# EAGLE design DualJoyDivision (EAGLE 7.6.0)
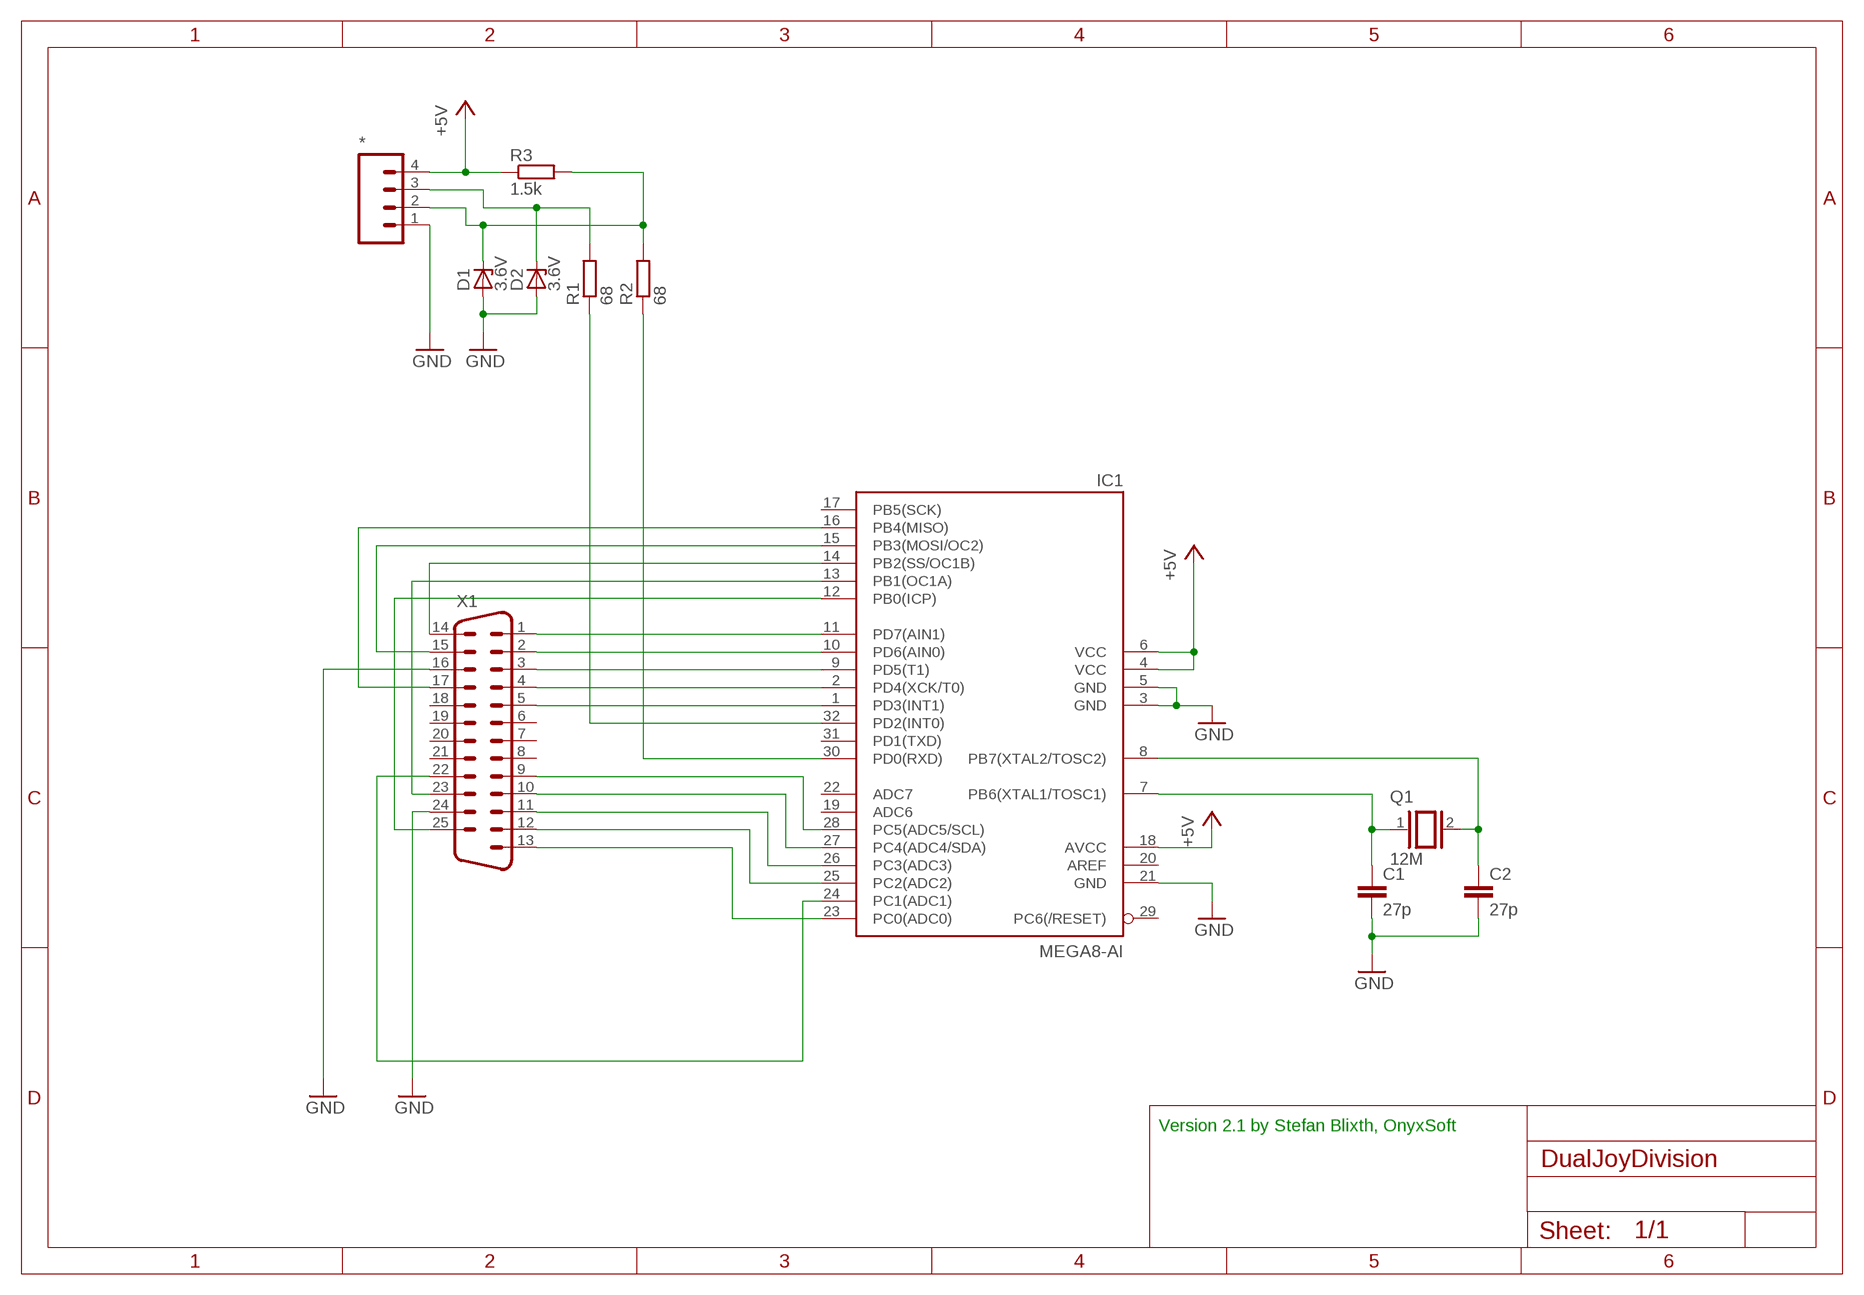
[diagram p0: schematic, sheet 1]

## Parts
*  M04PTH  [1X04]
C1  27p  C-EUC0805  [C0805]
C2  27p  C-EUC0805  [C0805]
D1  3.6V  ZENER-DIODESOD80C  [SOD80C]
D2  3.6V  ZENER-DIODESOD80C  [SOD80C]
IC1  MEGA8-AI  [TQFP32-08]
Q1  12M  XTAL/S  [QS]
R1  68  R-EU_M0805  [M0805]
R2  68  R-EU_M0805  [M0805]
R3  1.5k  R-EU_M0805  [M0805]
X1  DB25D  [M25D]

## Nets
+5V: *.4 IC1.4(VCC) IC1.6(VCC) IC1.18(AVCC) R3.1
GND: *.1 C1.2 C2.2 D1.A D2.A IC1.3(GND) IC1.5(GND) IC1.21(GND) X1.16 X1.24
N$1: *.2 D1.C R2.2 R3.2
N$2: *.3 D2.C R1.2
N$3: IC1.30(PD0(RXD)) R2.1
N$4: IC1.32(PD2(INT0)) R1.1
N$5: C1.1 IC1.7(PB6(XTAL1/TOSC1)) Q1.1
N$6: C2.1 IC1.8(PB7(XTAL2/TOSC2)) Q1.2
N$9: IC1.28(PC5(ADC5/SCL)) X1.9
N$10: IC1.27(PC4(ADC4/SDA)) X1.10
N$11: IC1.26(PC3(ADC3)) X1.11
N$12: IC1.25(PC2(ADC2)) X1.12
N$13: IC1.24(PC1(ADC1)) X1.22
N$14: IC1.23(PC0(ADC0)) X1.13
N$15: IC1.12(PB0(ICP)) X1.25
N$19: IC1.13(PB1(OC1A)) X1.23
N$20: IC1.11(PD7(AIN1)) X1.1
N$21: IC1.10(PD6(AIN0)) X1.2
N$22: IC1.9(PD5(T1)) X1.3
N$23: IC1.2(PD4(XCK/T0)) X1.4
N$24: IC1.1(PD3(INT1)) X1.5
N$25: IC1.14(PB2(SS/OC1B)) X1.14
N$26: IC1.15(PB3(MOSI/OC2)) X1.15
N$27: IC1.16(PB4(MISO)) X1.17
Unconnected: IC1.17(PB5(SCK)) IC1.19(ADC6) IC1.20(AREF) IC1.22(ADC7) IC1.29(PC6(/RESET)) IC1.31(PD1(TXD)) X1.6 X1.7 X1.8 X1.18 X1.19 X1.20 X1.21

## Notes on the sheet
- Version 2.1 by Stefan Blixth, OnyxSoft

## Library data of the parts
* = SparkFun-Connectors:M04: Header 4 Standard 4-pin 0.1" header. Use with straight break away headers (SKU : PRT-00116), right angle break away headers (PRT-00553), swiss pins (PRT-00743), machine pins (PRT-00117), and female headers (PRT-00115). Molex polarized connector foot print use with SKU : PRT-08231 with associated crimp pins and housings. 1MM SMD Version SKU: PRT-10208
C1 C2 = rcl:C-EU: CAPACITOR, European symbol
D1 D2 = diode:ZENER-DIODE: Z-Diode
IC1 = atmel:MEGA8: MICROCONTROLLER 8 Kbytes FLASH, 1 kbytes SRAM, 512 bytes EEPROM, USART, 6-channel 10 bit ADC, 2-channel 8 bit ADC Pin compatible with Atmega48, ATMega88, ATMega168 Source: avr.lbr; MPN: ATMEGA8-16AU; OC_FARNELL: 9171371; OC_NEWARK: 73M8863
Q1 = special:XTAL/S: CRYSTAL
R1-R3 = rcl:R-EU_: RESISTOR, European symbol
X1 = SparkFun-Connectors:DB25: Various DB25 connectors

## Board
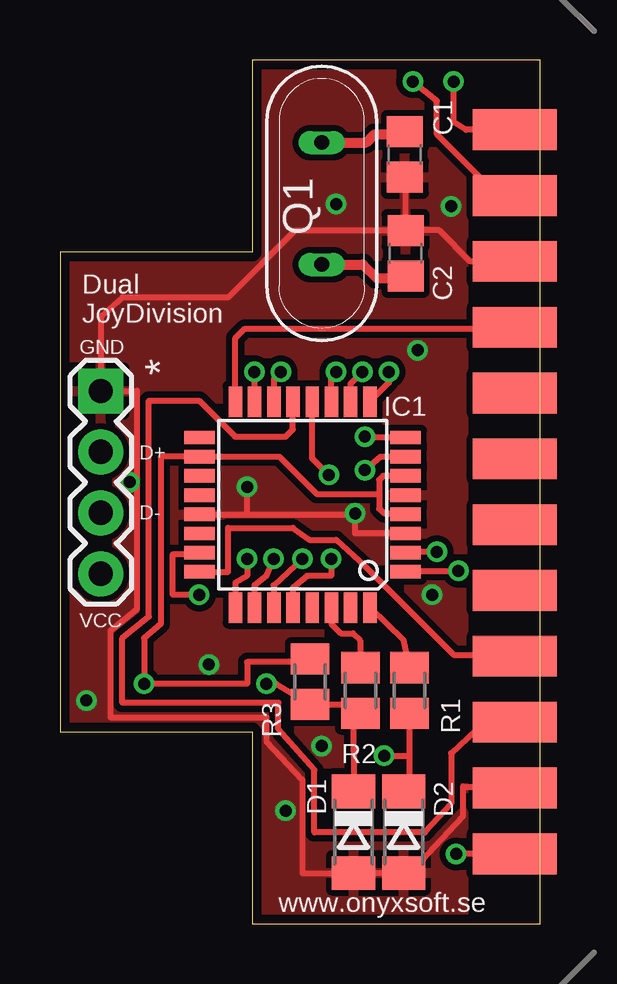
[diagram p1: board, top side]
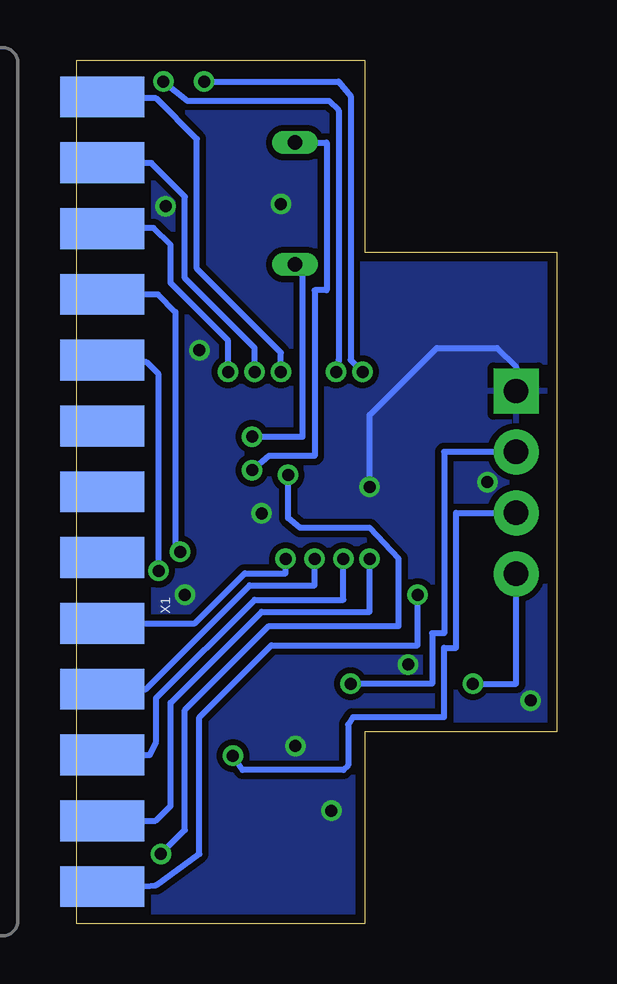
[diagram p2: board, bottom side, seen from below]

Size 20 x 36 mm. Coordinates in mm from the lower left corner, seen from the top.
Outline: 20,36 8,36 8,28 0,28 0,8 8,8 8,0 20,0 20,36
Copper layers (1*16): Top 0.0356mm / dielectric 1.5011mm / Bottom 0.0356mm
Design rules "oshpark-2layer": minimum track width 6mil, minimum drill 13mil, track to track 6mil, track to pad 6mil, pad to pad 6mil, via to via 6mil, smd to smd 6mil, copper to edge 15mil, drill to drill 6mil, minimum pad ring 7mil, minimum via ring 7mil, stop-mask expansion 2.5mil, vias tented up to drill 0mil, thermal gap 10mil

### Footprints (pad centres in the part's own frame; a part is rotated, then mirrored left to right if it is on the bottom)
1X04 = drill 1.016 pad 1.88 square: 1 0,0 | drill 1.016 pad 1.88: 2 2.54,0; 3 5.08,0; 4 7.62,0
C0805 = smd 1.3 x 1.5: 1 -0.95,0; 2 0.95,0
SOD80C = smd 1.4 x 1.8: A 1.7,0; C -1.7,0
TQFP32-08 = smd 1.27 x 0.559: 1 -4.293,2.8; 2 -4.293,2; 3 -4.293,1.2; 4 -4.293,0.4; 5 -4.293,-0.4; 6 -4.293,-1.2; 7 -4.293,-2; 8 -4.293,-2.8; 17 4.293,-2.8; 18 4.293,-2; 19 4.293,-1.2; 20 4.293,-0.4; 21 4.293,0.4; 22 4.293,1.2; 23 4.293,2; 24 4.293,2.8 | smd 0.559 x 1.27: 9 -2.8,-4.293; 10 -2,-4.293; 11 -1.2,-4.293; 12 -0.4,-4.293; 13 0.4,-4.293; 14 1.2,-4.293; 15 2,-4.293; 16 2.8,-4.293; 25 2.8,4.293; 26 2,4.293; 27 1.2,4.293; 28 0.4,4.293; 29 -0.4,4.293; 30 -1.2,4.293; 31 -2,4.293; 32 -2.8,4.293
QS = drill 0.61 long: 1 -2.54,0; 2 2.54,0
M0805 = smd 1.3 x 1.6: 1 -0.95,0; 2 0.95,0
M25D = smd 1.7 x 3.5: 1 16.459,-6.045; 2 13.716,-6.045; 3 10.973,-6.045; 4 8.23,-6.045; 5 5.486,-6.045; 6 2.743,-6.045; 7 0,-6.045; 8 -2.743,-6.045; 9 -5.486,-6.045; 10 -8.23,-6.045; 11 -10.973,-6.045; 12 -13.716,-6.045; 13 -16.459,-6.045 | smd 1.7 x 3.5 bottom: 14 15.088,-6.045; 15 12.344,-6.045; 16 9.601,-6.045; 17 6.858,-6.045; 18 4.115,-6.045; 19 1.372,-6.045; 20 -1.372,-6.045; 21 -4.115,-6.045; 22 -6.858,-6.045; 23 -9.601,-6.045; 24 -12.344,-6.045; 25 -15.088,-6.045

### Placement (x,y rotation side)
*  1.7,22.2 270 top
C1  14.37,32.06 270 top
C2  14.4,27.93 90 top
D1  12.23,3.81 270 top
D2  14.32,3.81 270 top
IC1  10.11,17.46 180 top
Q1  10.91,30.02 270 top
R1  14.56,9.72 270 top
R2  12.52,9.72 270 top
R3  10.42,10.08 270 top
X1  25,18 90 bottom

### Tracks (layer width: path | path; a pad name or v marks a point on that pad's centre or on a via)
+5V  (via drill 0.5)
  Top 0.254: IC1.6 13.46,18.66 13.3,18.5 13.3,17.9 | 13.3,17.9 13.3,17.3 13.5,17.1 14.36,17.1 IC1.4 | 13.3,17.9 10.7,17.9 9.14,19.46 IC1.18 4.2,19.46 4.2,12.5 3.5,11.9 v3.5,10 7.8,10 7.8,10.9 10.19,10.9 R3.1
  Bottom 0.254: v3.5,10 1.7,10 *.4
GND  (via drill 0.5)
  Top 0.254: 12.3,17.06 IC1.21 7.8,17.06 v7.8,18.2 | 14.4,16.2 14.34,16.2 IC1.3 12.3,16.26 v12.3,17.1 12.3,17.06 | C1.2 C2.2 | X1.24 18.95,5.7 16.8,5.7 16.8,4.5 15.6,3.2 14.6,2.11 D2.A D1.A 12.14,2.1 10.1,2.1 10.1,6 8.6,7.6 8.6,8.6 2.1,8.6 2.1,12.2 3.2,13.1 3.2,22.2 *.1 1.7,25.3 2.6,26.1 7,26.1 9.79,28.89 C2.2 | X1.16 17.1,27.6 15.8,28.9 14.21,28.9 C2.2 | 12.34,17.06 12.3,17.06
  Bottom 0.254: v7.8,18.2 7.8,21.2 5,24 2.5,24 1.7,23.2 *.1
  other vias: 11.5,30 9.4,4.7 6.2,10.8 10.9,7.4 15.5,13.7 1.1,9.3 2.9,18.4 16.3,29.9 14.9,23.9
  pour Top (isolate 0.254): 0,28 8.1,28 8.1,36.1 16.8,36 16.8,-0.1 8,0 8,8 0,8
  pour Bottom (isolate 0.254): 0,28 8.1,28 8.1,36.1 16.8,36.1 16.8,0 8,0 8,8 0,8
N$1  (via drill 0.5)
  Top 0.254: D1.C 12.22,8.82 R2.2 12.28,9.13 R3.2 9,10 v8.6,10
  Bottom 0.254: *.2 4.7,19.66 4.7,12.1 5.2,12.1 5.2,10 v8.6,10
N$2  (via drill 0.5)
  Top 0.254: v13.5,7 14.56,7 | R1.2 14.56,7 | 14.56,7 14.56,5.51 D2.C
  Bottom 0.254: v13.5,7 13.1,6.4 8.9,6.4 8.7,6.6 8.7,8.3 8.5,8.6 4.7,8.6 4.7,11.5 4.2,11.5 4.2,17.12 *.3
N$3
  Top 0.254: IC1.30 11.31,12.49 11.7,12.1 12.2,12.1 12.5,11.8 12.5,10.68 R2.1
N$4
  Top 0.254: IC1.32 14.31,11.81 R1.1
N$5  (via drill 0.5)
  Top 0.254: v12.7,18.9 13.36,19.46 IC1.7
  Top 0.406: Q1.1 12.76,32.56 13.1,32.9 14.05,32.9 C1.1
  Bottom 0.254: Q1.1 9.6,32.56 9.6,26.4 10.1,26.4 10.1,19.5 12,19.5 v12.7,18.9
N$6  (via drill 0.5)
  Top 0.254: IC1.8 12.74,20.26 v12.7,20.3
  Top 0.406: Q1.2 12.62,27.48 13.2,26.9 14.11,26.9 C2.1
  Bottom 0.254: v12.7,20.3 10.6,20.3 10.6,27 Q1.2
N$9  (via drill 0.5)
  Top 0.254: v11.3,15.2 11.3,14.5 10.3,14.5 9.7,14 IC1.28
  Bottom 0.254: X1.9 15.09,12.51 13,14.6 11.3,14.6 v11.3,15.2
N$10  (via drill 0.5)
  Top 0.254: v10.1,15.2 8.9,14.1 IC1.27
  Bottom 0.254: X1.10 17.13,9.77 12.8,14.1 10.1,14.1 v10.1,15.2
N$11  (via drill 0.5)
  Top 0.254: v8.9,15.2 8.6,14.5 8.1,14.1 IC1.26
  Bottom 0.254: X1.11 16.97,7.03 16.7,7.6 16.7,9.4 12.6,13.5 8.9,13.5 v8.9,15.2
N$12  (via drill 0.5)
  Top 0.254: v7.8,15.2 7.8,14.5 7.31,14.2 IC1.25
  Bottom 0.254: X1.12 16.72,4.28 16.1,4.9 16.1,9.2 12.3,13 7.8,13 v7.8,15.2
N$13
  Top 0.254: IC1.24 7,14.66 7,16.5 9.7,16.5 10.4,16 11.5,16 12.7,14.9 16.4,11.2 18.9,11.2 X1.22
N$14  (via drill 0.5)
  Top 0.254: v5.8,13.7 4.7,13.7 4.7,15.4 5.92,15.4 IC1.23
  Bottom 0.254: X1.13 17.46,1.54 16.7,1.6 14.9,2.9 14.9,8.6 11.9,11.6 5.8,11.6 v5.8,13.7
N$15  (via drill 0.5)
  Top 0.254: X1.25 16.51,2.91 v16.5,2.9 | v11.2,18.7 10.51,19.39 IC1.12
  Bottom 0.254: v16.5,2.9 15.5,3.9 15.5,8.9 12,12.4 6.6,12.4 6.6,15.2 7.8,16.5 10.7,16.5 11.2,16.9 v11.2,18.7
N$19
  Top 0.254: X1.23 17.7,8.4 16.3,7.1 16.3,5 15.2,3.8 10.6,3.8 10.6,6.4 9.1,8.1 9.1,9.2 2.6,9.2 2.6,11.9 3.7,12.8 3.7,21.8 5.8,21.8 7.3,20.3 9.4,20.3 9.7,20.6 IC1.13
N$20  (via drill 0.5)
  Top 0.254: IC1.11 11.31,22.81 v11.5,23
  Bottom 0.254: v11.5,23 11.5,23.8 15,27.3 15,32.7 16.7,34.4 18.9,34.4 X1.1
N$21  (via drill 0.5)
  Top 0.254: IC1.10 12.11,22.51 v12.6,23
  Bottom 0.254: v12.6,23 12.6,24 15.5,26.9 15.5,30.3 16.9,31.7 18.94,31.7 X1.2
N$22  (via drill 0.5)
  Top 0.254: IC1.9 13.7,22.54 v13.7,23
  Bottom 0.254: v13.7,23 13.7,24.3 16.1,26.7 16.1,28.3 16.8,29 18.93,29 X1.3
N$23  (via drill 0.5)
  Top 0.254: v15.7,15.5 14.44,15.5 IC1.2
  Bottom 0.254: X1.4 16.63,26.23 15.9,25.5 15.9,15.7 v15.7,15.5
N$24  (via drill 0.5)
  Top 0.254: IC1.1 14.4,14.7 v16.6,14.7
  Bottom 0.254: v16.6,14.7 16.6,22.9 17.1,23.4 18.87,23.4 X1.5
N$25  (via drill 0.5)
  Top 0.254: X1.14 16.91,33.09 16.4,33.4 v16.4,35.1 | v9.2,23 8.91,22.71 IC1.14
  Bottom 0.254: v16.4,35.1 15.4,34.3 9.5,34.3 9.1,33.9 9.1,23.5 v9.2,23
N$26  (via drill 0.5)
  Top 0.254: X1.15 18.26,30.34 15.7,32.9 15.7,34.3 v14.7,35.1 | v8.1,23 8.1,21.76 IC1.15
  Bottom 0.254: v14.7,35.1 9.1,35.1 8.6,34.5 8.6,23.5 v8.1,23
N$27
  Top 0.254: IC1.16 7.31,24.41 7.7,24.8 18.9,24.8 X1.17

### Text on the board
tNames: Dual / JoyDivision | GND | D+ | D- | VCC | www.onyxsoft.se